# EAGLE design v2-quadcopter-control-board (EAGLE 5.12)
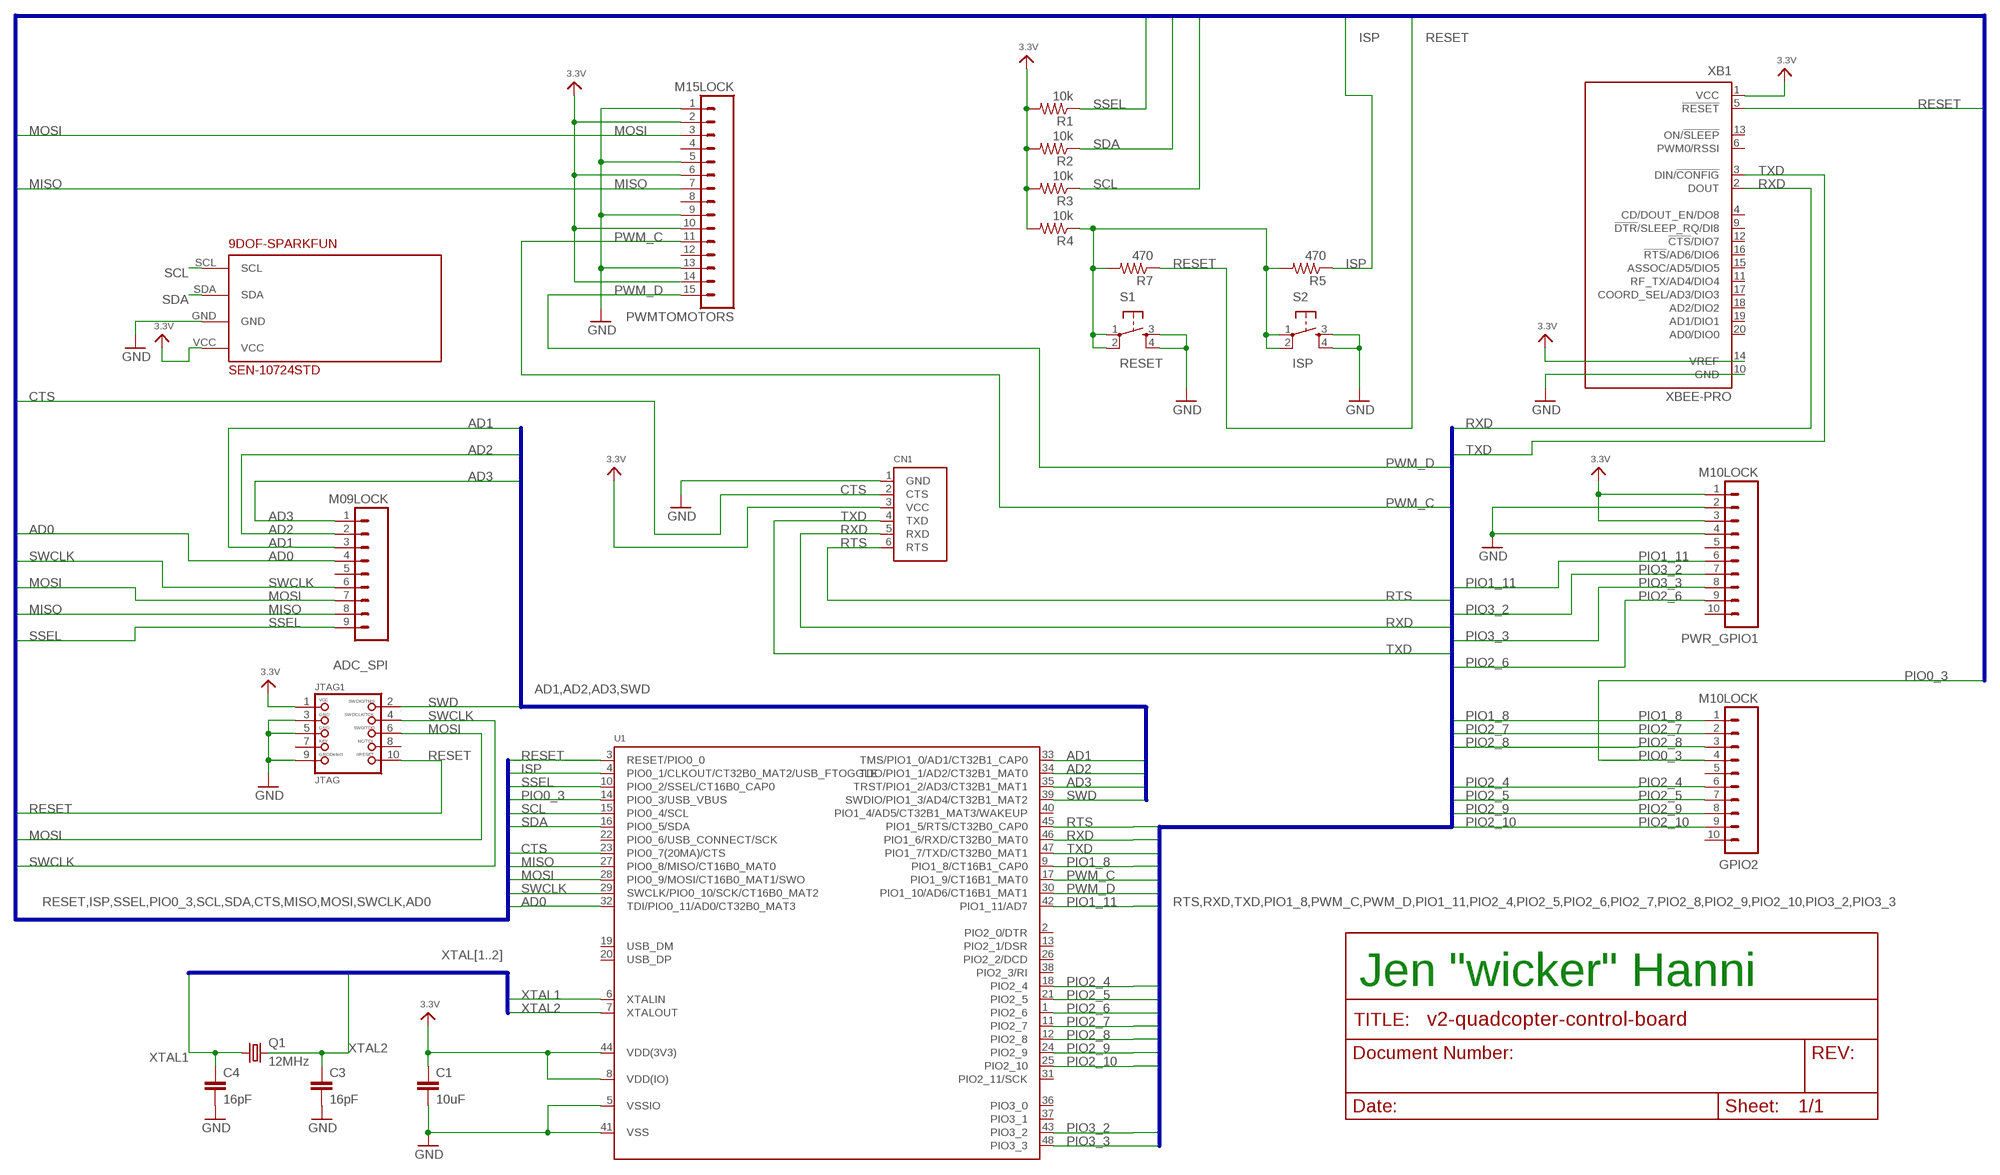
[diagram p0: schematic, sheet 1]

## Parts
9DOF-SPARKFUN  SEN-10724STD  [SPARKFUN-9DOF]
ADC_SPI  M09LOCK  [1X09_LOCK]
C1  10uF  CAP0603-CAP  [0603-CAP]
C3  16pF  CAP0603-CAP  [0603-CAP]
C4  16pF  CAP0603-CAP  [0603-CAP]
CN1  FTDIUSBCABLE  [1X06_ROUND]
GPIO2  M10LOCK  [1X10_LOCK]
JTAG1  JTAG  JTAG-CORTEXM3MOLEX  [CORTEXM3_SWD10_MOLEX]
PWMTOMOTORS  M15LOCK  [1X15_LOCK]
PWR_GPIO1  M10LOCK  [1X10_LOCK]
Q1  12MHz  CRYSTALCTS406  [CTS406]
R1  10k  RESISTOR0603-RES  [0603-RES]
R2  10k  RESISTOR0603-RES  [0603-RES]
R3  10k  RESISTOR0603-RES  [0603-RES]
R4  10k  RESISTOR0603-RES  [0603-RES]
R5  470  RESISTOR0603-RES  [0603-RES]
R7  470  RESISTOR0603-RES  [0603-RES]
S1  RESET  TAC_SWITCHSMD  [TACTILE_SWITCH_SMD]
S2  ISP  TAC_SWITCHSMD  [TACTILE_SWITCH_SMD]
U1  LPC1343_QFP  [LQFP48]
XB1  XBEE-PRO  [XBEE-PRO]

## Nets
3.3V: 9DOF-SPARKFUN.VCC C1.1 CN1.3(VCC) JTAG1.1 PWMTOMOTORS.2 PWMTOMOTORS.6 PWMTOMOTORS.10 PWMTOMOTORS.14 PWR_GPIO1.1 PWR_GPIO1.3 R1.2 R2.2 R3.2 R4.2 U1.8(VDD(IO)) U1.44(VDD(3V3)) XB1.1(VCC) XB1.14(VREF)
AD0: ADC_SPI.4 U1.32(TDI/PIO0_11/AD0/CT32B0_MAT3)
AD1: ADC_SPI.3 U1.33(TMS/PIO1_0/AD1/CT32B1_CAP0)
AD2: ADC_SPI.2 U1.34(TDO/PIO1_1/AD2/CT32B1_MAT0)
AD3: ADC_SPI.1 U1.35(TRST/PIO1_2/AD3/CT32B1_MAT1)
CTS: CN1.2(CTS) U1.23(PIO0_7(20MA)/CTS)
GND: 9DOF-SPARKFUN.GND C1.2 C3.2 C4.2 CN1.1(GND) JTAG1.3 JTAG1.5 JTAG1.9 PWMTOMOTORS.1 PWMTOMOTORS.5 PWMTOMOTORS.9 PWMTOMOTORS.13 PWR_GPIO1.2 PWR_GPIO1.4 S1.3 S1.4 S2.3 S2.4 U1.5(VSSIO) U1.41(VSS) XB1.10(GND)
ISP: R5.1 U1.4(PIO0_1/CLKOUT/CT32B0_MAT2/USB_FTOGGLE)
MISO: ADC_SPI.8 PWMTOMOTORS.7 U1.27(PIO0_8/MISO/CT16B0_MAT0)
MOSI: ADC_SPI.7 JTAG1.6 PWMTOMOTORS.3 U1.28(PIO0_9/MOSI/CT16B0_MAT1/SWO)
N$7: R4.1 R5.2 R7.2 S1.1 S1.2 S2.1 S2.2
PIO0_3: GPIO2.4 U1.14(PIO0_3/USB_VBUS)
PIO1_8: GPIO2.1 U1.9(PIO1_8/CT16B1_CAP0)
PIO1_11: PWR_GPIO1.6 U1.42(PIO1_11/AD7)
PIO2_4: GPIO2.6 U1.18(PIO2_4)
PIO2_5: GPIO2.7 U1.21(PIO2_5)
PIO2_6: PWR_GPIO1.9 U1.1(PIO2_6)
PIO2_7: GPIO2.2 U1.11(PIO2_7)
PIO2_8: GPIO2.3 U1.12(PIO2_8)
PIO2_9: GPIO2.8 U1.24(PIO2_9)
PIO2_10: GPIO2.9 U1.25(PIO2_10)
PIO3_2: PWR_GPIO1.7 U1.43(PIO3_2)
PIO3_3: PWR_GPIO1.8 U1.48(PIO3_3)
PWM_C: PWMTOMOTORS.11 U1.17(PIO1_9/CT16B1_MAT0)
PWM_D: PWMTOMOTORS.15 U1.30(PIO1_10/AD6/CT16B1_MAT1)
RESET: JTAG1.10 R7.1 U1.3(RESET/PIO0_0) XB1.5(!RESET)
RTS: CN1.6(RTS) U1.45(PIO1_5/RTS/CT32B0_CAP0)
RXD: CN1.5(RXD) U1.46(PIO1_6/RXD/CT32B0_MAT0) XB1.2(DOUT)
SCL: 9DOF-SPARKFUN.SCL R3.1 U1.15(PIO0_4/SCL)
SDA: 9DOF-SPARKFUN.SDA R2.1 U1.16(PIO0_5/SDA)
SSEL: ADC_SPI.9 R1.1 U1.10(PIO0_2/SSEL/CT16B0_CAP0)
SWCLK: ADC_SPI.6 JTAG1.4 U1.29(SWCLK/PIO0_10/SCK/CT16B0_MAT2)
SWD: JTAG1.2 U1.39(SWDIO/PIO1_3/AD4/CT32B1_MAT2)
TXD: CN1.4(TXD) U1.47(PIO1_7/TXD/CT32B0_MAT1) XB1.3(DIN/!CONFIG)
XTAL1: C4.1 Q1.1 U1.6(XTALIN)
XTAL2: C3.1 Q1.3 U1.7(XTALOUT)
Unconnected: ADC_SPI.5 GPIO2.5 GPIO2.10 JTAG1.7 JTAG1.8 PWMTOMOTORS.4 PWMTOMOTORS.8 PWMTOMOTORS.12 PWR_GPIO1.5 PWR_GPIO1.10 U1.2(PIO2_0/DTR) U1.13(PIO2_1/DSR) U1.19(USB_DM) U1.20(USB_DP) U1.22(PIO0_6/USB_CONNECT/SCK) U1.26(PIO2_2/DCD) U1.31(PIO2_11/SCK) U1.36(PIO3_0) U1.37(PIO3_1) U1.38(PIO2_3/RI) U1.40(PIO1_4/AD5/CT32B1_MAT3/WAKEUP) XB1.4(CD/DOUT_EN/DO8) XB1.6(PWM0/RSSI) XB1.9(!DTR!/SLEEP_RQ/DI8) XB1.11(RF_TX/AD4/DIO4) XB1.12(!CTS!/DIO7) XB1.13(ON/!SLEEP) XB1.15(ASSOC/AD5/DIO5) XB1.16(!RTS!/AD6/DIO6) XB1.17(COORD_SEL/AD3/DIO3) XB1.18(AD2/DIO2) XB1.19(AD1/DIO1) XB1.20(AD0/DIO0)

## Buses
XTAL[1..2]
RESET,ISP,SSEL,PIO0_3,SCL,SDA,CTS,MISO,MOSI,SWCLK,AD0
AD1,AD2,AD3,SWD
RTS,RXD,TXD,PIO1_8,PWM_C,PWM_D,PIO1_11,PIO2_4,PIO2_5,PIO2_6,PIO2_7,PIO2_8,PIO2_9,PIO2_10,PIO3_2,PIO3_3

## Notes on the sheet
- Jen "wicker" Hanni

## Library data of the parts
9DOF-SPARKFUN = wicker:SEN-10724
ADC_SPI = sparkfun:M09: Header 9 Standard 9-pin 0.1" header. Use with straight break away headers (SKU : PRT-00116), right angle break away headers (PRT-00553), swiss pins (PRT-00743), machine pins (PRT-00117), and female headers (PRT-00115).
C1 C3 C4 = sparkfun:CAP: Capacitor Standard 0603 ceramic capacitor, and 0.1" leaded capacitor.
CN1 = microbuilder:FTDIUSBCABLE: FTDI TTL-232R USB Cable Connector for FTDI's USB->RS232 Cable
GPIO2 PWR_GPIO1 = sparkfun:M10: Header 10 Standard 10-pin 0.1" header. Use with straight break away headers (SKU : PRT-00116), right angle break away headers (PRT-00553), swiss pins (PRT-00743), machine pins (PRT-00117), and female headers (PRT-00115).
JTAG1 = microbuilder:JTAG-CORTEXM3: Serial Wire (SW-DP) Connector This standard 0.05" 10-pin connector is for use with the Cortex M0/M3's native SWD (serial wire debugger) interface (SW-DP). Some boards support a 20-pin combined JTAG+SWD connector (SWJ-DP), such as the LPC1700 family, but many smaller devices only work with SWD which typically use the smaller 10-pin SW-DP connecter (the LPC1300 family, for example, only supports SWD). 2x05 1.27mm/0.05" Connector: This is the standard SMT connector defined by ARM for all Cortex devices, and should be used in most situations and for forward-compatibility since any new devices coming to market will likely use this connector. MOLEX 10 Pin 0.1" Connector: This 0.1" 10 pin connector has the same pin layout as the standard 0.05" connector, but is easier to work with if you are using standard jumper wires or custom cables to connect your SWD hardware. MOLEX 20 Pin 0.1" Connector: This 0.1" 20 pin connector is the same model used for ARM7/ARM9 JTAG debuggers, but is connected to match the pins on the Segger J-Link for ARM (which supports both JTAG and SWD debugging). See the following document from ARM for more information on Cortex M3 Debug Connectors: http://infocenter.arm.com/help/topic/com.arm.doc.faqs/attached/13634/cortex_debug_connectors.pdf And the following page for an overview with images of the different connector types: http://www.keil.com/peripherals/coresight/connectors.asp
PWMTOMOTORS = sparkfun:M15: Header 15 Standard 15-pin 0.1" header. Use with straight break away headers (SKU : PRT-00116), right angle break away headers (PRT-00553), swiss pins (PRT-00743), machine pins (PRT-00117), and female headers (PRT-00115).
Q1 = crystal:CRYSTAL: CRYSTAL
R1-R5 R7 = sparkfun:RESISTOR: Resistor Basic schematic elements and footprints for 0603, 1206, and PTH resistors.
S1 S2 = sparkfun:TAC_SWITCH: Momentary Switch Button commonly used for reset or general input. Spark Fun Electronics SKU : COM-00097
U1 = microbuilder:LPC1343_QFP: LPC1343 72 MHz 32-bit ARM Cortex-M3 microcontroller. 32 kB Flash, 8 kB SRAM, USB Device Mouser: 771-LPC1343FBD48151 Digikey: 568-4945-ND; DIGIKEY#: 568-4945-ND; MANF: NXP; MANF#: LPC1343FBD48,151
XB1 = microbuilder:XBEE: XBee (TM) /XBee-PRO(TM) OEM RF Modules Source: MaxStream, Inc. xbee_productmanual.pdf

## Board
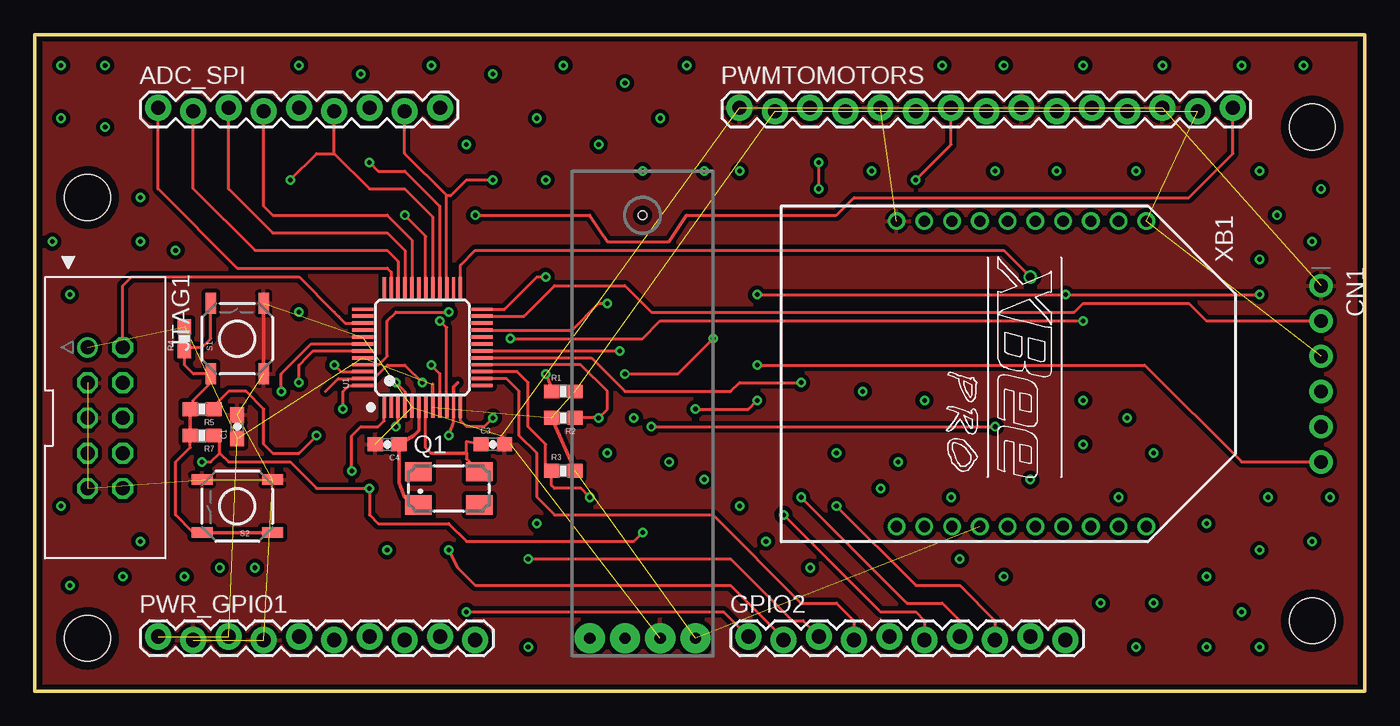
[diagram p1: board, top side]
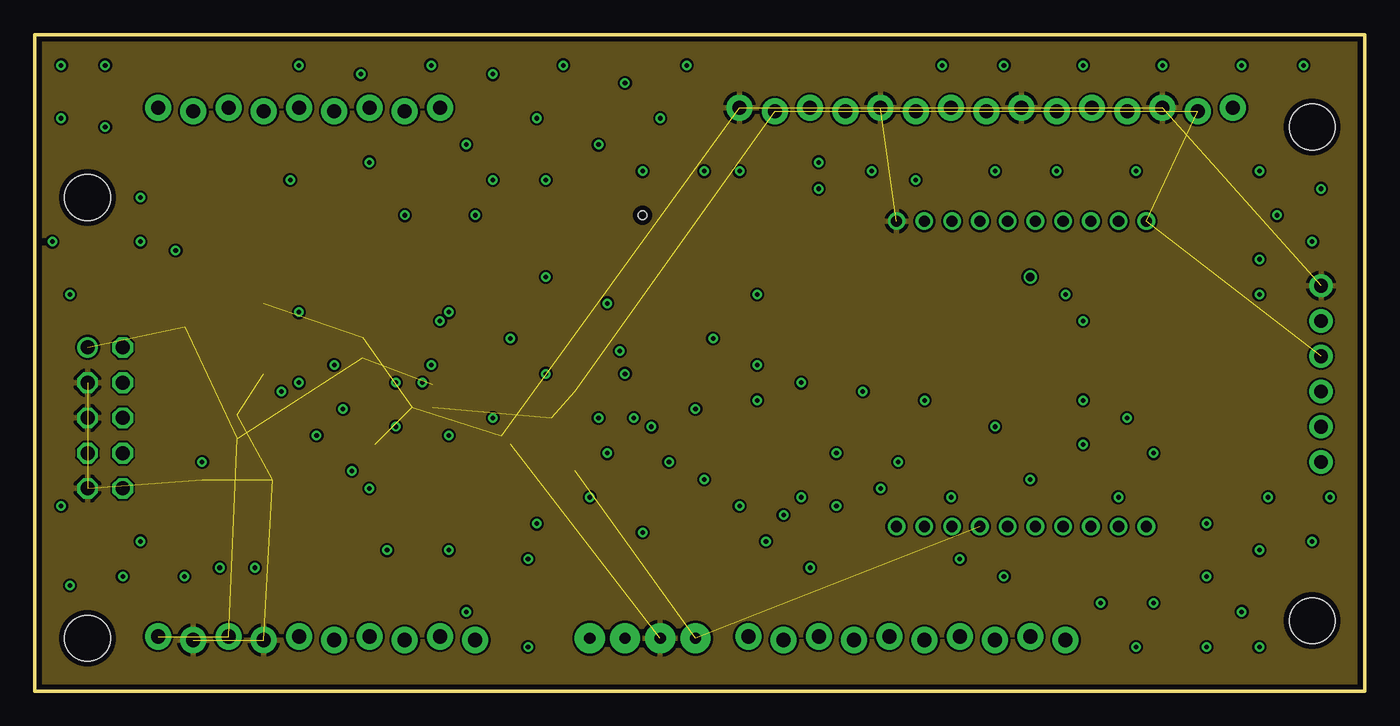
[diagram p2: board, inner layer $GND-PLANE]
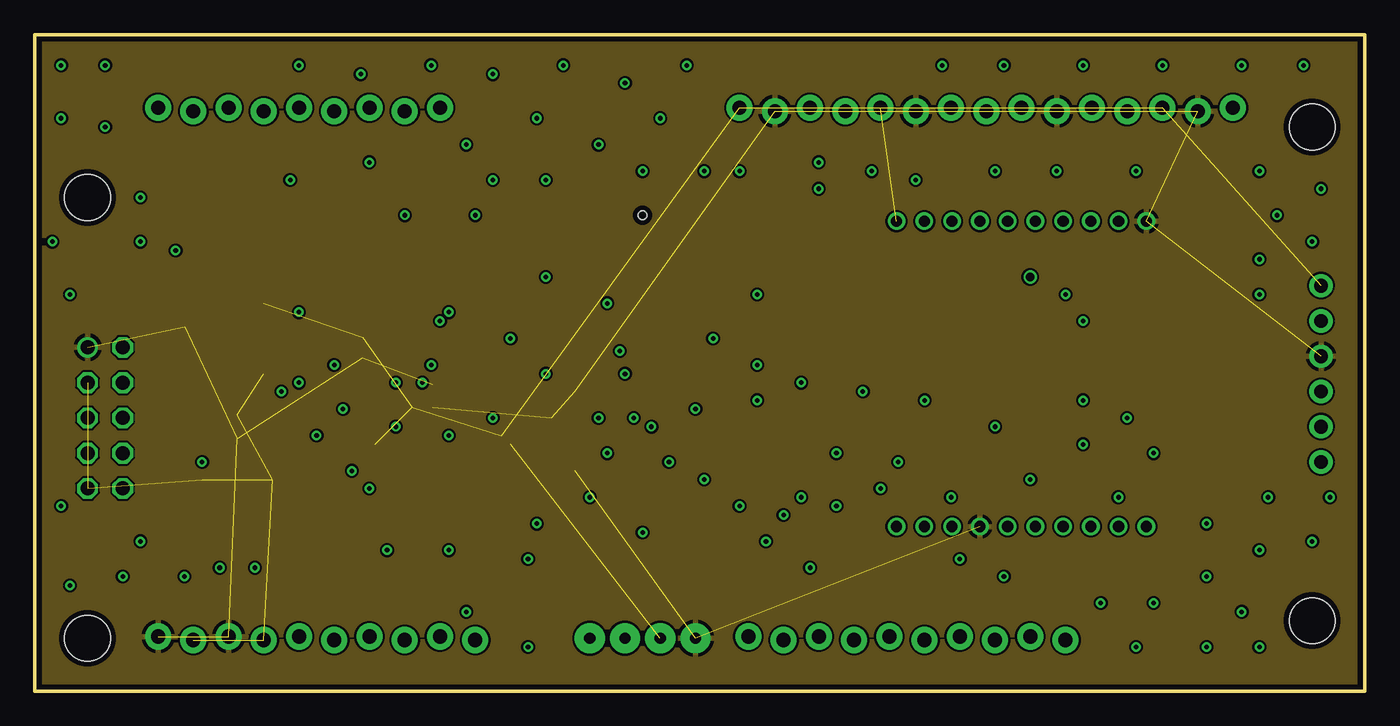
[diagram p3: board, inner layer $POWER-PLANE]
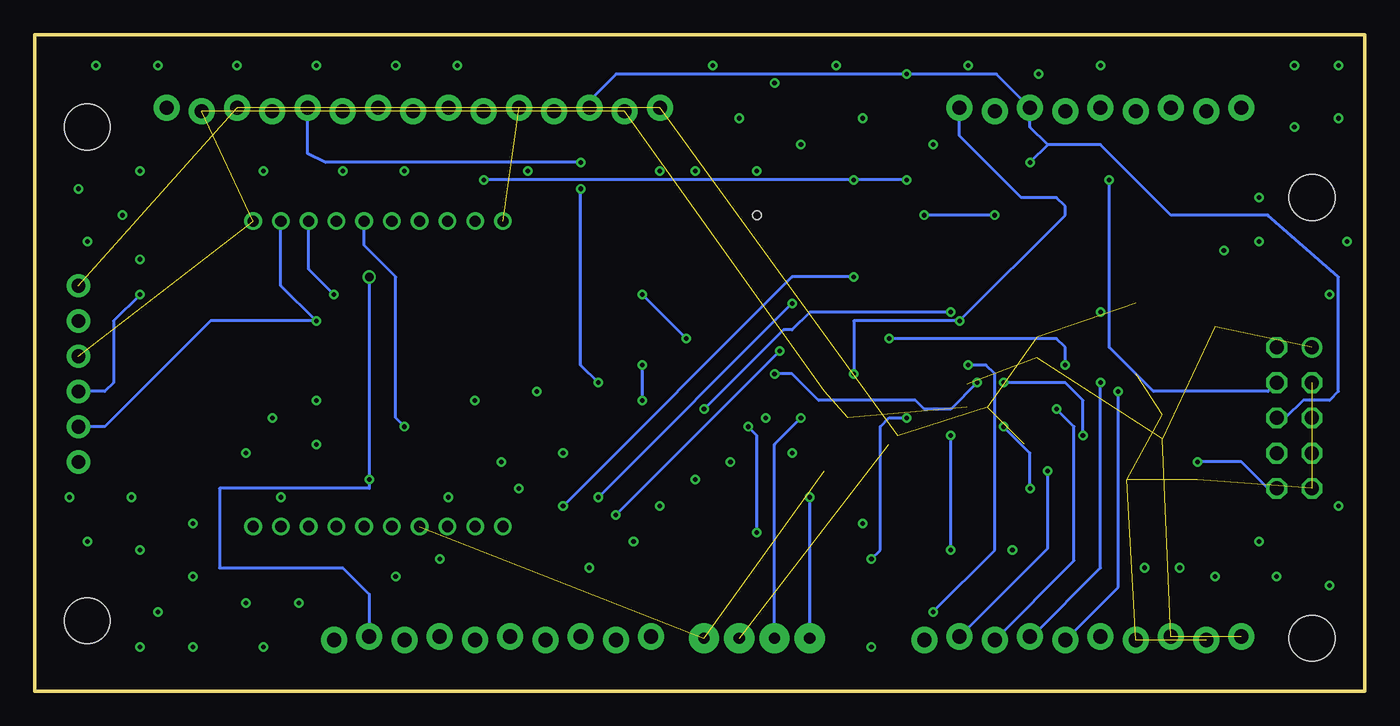
[diagram p4: board, bottom side, seen from below]

Size 95.86 x 47.3 mm. Coordinates in mm from the lower left corner, seen from the top.
Outline: 0,0 95.86,0 95.86,47.3 0,47.3 0,0
Copper layers (1*2+15*16): Top 0.0356mm / dielectric 1.5011mm / $GND-PLANE 0.0356mm / dielectric 0.1499mm / $POWER-PLANE 0.0356mm / dielectric 0.2007mm / Bottom 0.0356mm
Design rules "LaenPCBOrder *": minimum track width 6mil, minimum drill 13mil, track to track 6mil, track to pad 6mil, pad to pad 6mil, via to via 6mil, smd to smd 6mil, copper to edge 15mil, drill to drill 6mil, minimum pad ring 7mil, minimum via ring 7mil, stop-mask expansion 4mil, vias tented up to drill 0mil, thermal gap 10mil

### Footprints (pad centres in the part's own frame; a part is rotated, then mirrored left to right if it is on the bottom)
SPARKFUN-9DOF = drill 0.8 pad 2.184 round: GND 1.27,3.81; SCL 1.27,8.89; SDA 1.27,6.35; VCC 1.27,1.27 | hole 0.6: 31.75,5.08
1X09_LOCK = drill 1.016 pad 1.88 round: 1 0,0.127; 2 2.54,-0.127; 3 5.08,0.127; 4 7.62,-0.127; 5 10.16,0.127; 6 12.7,-0.127; 7 15.24,0.127; 8 17.78,-0.127; 9 20.32,0.127
0603-CAP = smd 1.1 x 1: 1 -0.85,0; 2 0.85,0
1X06_ROUND = drill 1 pad 1.676 round: 1 -6.35,0; 2 -3.81,0; 3 -1.27,0; 4 1.27,0; 5 3.81,0; 6 6.35,0
1X10_LOCK = drill 1.016 pad 1.88 round: 1 0,0.127; 2 2.54,-0.127; 3 5.08,0.127; 4 7.62,-0.127; 5 10.16,0.127; 6 12.7,-0.127; 7 15.24,0.127; 8 17.78,-0.127; 9 20.32,0.127; 10 22.86,-0.127
CORTEXM3_SWD10_MOLEX = drill 1 round: 1 -5.08,-1.27 | drill 1 octagon: 2 -5.08,1.27; 3 -2.54,-1.27; 4 -2.54,1.27; 5 0,-1.27; 6 0,1.27; 7 2.54,-1.27; 8 2.54,1.27; 9 5.08,-1.27; 10 5.08,1.27
1X15_LOCK = drill 1.016 pad 1.88 round: 1 0,0.127; 2 2.54,-0.127; 3 5.08,0.127; 4 7.62,-0.127; 5 10.16,0.127; 6 12.7,-0.127; 7 15.24,0.127; 8 17.78,-0.127; 9 20.32,0.127; 10 22.86,-0.127; 11 25.4,0.127; 12 27.94,-0.127; 13 30.48,0.127; 14 33.02,-0.127; 15 35.56,0.127
CTS406 = smd 1.9 x 1.4: 1 -2.2,-1.2; 2 2.2,-1.2; 3 2.2,1.2; 4 -2.2,1.2
0603-RES = smd 1.1 x 1: 1 -0.85,0; 2 0.85,0
TACTILE_SWITCH_SMD = smd 1.524 x 0.762: 1 -2.54,1.905; 2 2.54,1.905; 3 -2.54,-1.905; 4 2.54,-1.905
LQFP48 = smd 1.5 x 0.25: 1 -4.3,2.75; 2 -4.3,2.25; 3 -4.3,1.75; 4 -4.3,1.25; 5 -4.3,0.75; 6 -4.3,0.25; 7 -4.3,-0.25; 8 -4.3,-0.75; 9 -4.3,-1.25; 10 -4.3,-1.75; 11 -4.3,-2.25; 12 -4.3,-2.75; 25 4.3,-2.75; 26 4.3,-2.25; 27 4.3,-1.75; 28 4.3,-1.25; 29 4.3,-0.75; 30 4.3,-0.25; 31 4.3,0.25; 32 4.3,0.75; 33 4.3,1.25; 34 4.3,1.75; 35 4.3,2.25; 36 4.3,2.75 | smd 0.25 x 1.5: 13 -2.75,-4.3; 14 -2.25,-4.3; 15 -1.75,-4.3; 16 -1.25,-4.3; 17 -0.75,-4.3; 18 -0.25,-4.3; 19 0.25,-4.3; 20 0.75,-4.3; 21 1.25,-4.3; 22 1.75,-4.3; 23 2.25,-4.3; 24 2.75,-4.3; 37 2.75,4.3; 38 2.25,4.3; 39 1.75,4.3; 40 1.25,4.3; 41 0.75,4.3; 42 0.25,4.3; 43 -0.25,4.3; 44 -0.75,4.3; 45 -1.25,4.3; 46 -1.75,4.3; 47 -2.25,4.3; 48 -2.75,4.3
STAND-OFF = hole 3.302: 0,0
XBEE-PRO = drill 0.8 pad 1.27 round: 1 -11,9; 2 -11,7; 3 -11,5; 4 -11,3; 5 -11,1; 6 -11,-1; 7 -11,-3; 8 -11,-5; 9 -11,-7; 10 -11,-9; 11 11,-9; 12 11,-7; 13 11,-5; 14 11,-3; 15 11,-1; 16 11,1; 17 11,3; 18 11,5; 19 11,7; 20 11,9

### Placement (x,y rotation side)
9DOF-SPARKFUN  48.9,2.54 90 top
ADC_SPI  8.89,41.91 0 top
C1  14.61,19.05 90 top
C3  33.02,17.78 0 top
C4  25.4,17.78 180 top
CN1  92.71,22.86 270 top
GPIO2  51.44,3.81 0 top
JTAG1  5.08,19.68 270 top
PWMTOMOTORS  50.8,41.91 0 top
PWR_GPIO1  8.89,3.81 0 top
Q1  29.84,14.61 0 top
R1  38.1,21.59 0 top
R2  38.1,19.68 180 top
R3  38.1,15.88 0 top
R4  10.79,25.4 90 top
R5  12.06,20.32 180 top
R7  12.06,18.41 180 top
S1  14.61,25.4 90 top
S2  14.61,13.34 180 top
U1  27.94,24.77 90 top
U$4  [STAND-OFF]  3.81,35.56 0 top
U$5  [STAND-OFF]  3.81,3.81 0 top
U$6  [STAND-OFF]  92.08,40.64 0 top
U$7  [STAND-OFF]  92.08,5.08 0 top
XB1  71.12,22.86 270 top

### Tracks (layer width: path | path; a pad name or v marks a point on that pad's centre or on a via)
3.3V  (16 unrouted)
  Top 0.254: R3.2 R2.2 | U1.8 28.69,22.11
  pour $POWER-PLANE: 95.89,46.99 95.89,0 0,0 0,46.99
AD0
  Top 0.203: U1.32 27.19,32.5 25.4,34.29 17.14,34.29 16.51,34.92 ADC_SPI.4
AD1
  Top 0.203: U1.33 26.69,31.73 25.4,33.02 17.14,33.02 13.97,36.2 ADC_SPI.3
AD2
  Top 0.203: U1.34 26.19,30.96 25.4,31.75 15.88,31.75 11.43,36.2 ADC_SPI.2
AD3
  Top 0.203: U1.35 25.69,30.19 25.4,30.48 14.61,30.48 8.89,36.2 ADC_SPI.1
CTS
  Top 0.203: U1.23 35.27,27.02 37.47,29.21 42.55,29.21 44.45,27.3 74.93,27.3 75.56,27.94 83.19,27.94 84.45,26.67 CN1.2
GND  (19 unrouted)
  Top 0.254: S1.3 S1.4 | C3.2 33.66,18.41 34.29,17.78
  pour $GND-PLANE: 0,0 95.89,0 95.89,47.62 0,47.62
  pour Top (isolate 0.305): 0.64,46.99 0.64,0 95.25,0 95.25,46.99
ISP  (via drill 0.33)
  Top 0.203: U1.4 26.69,21.57 v26.04,22.23 | R5.1 12.91,20.54 13.97,21.59 15.24,21.59 16.51,20.32 16.51,17.78 17.14,17.14 19.05,17.14 v20.32,18.41
  Bottom 0.203: v26.04,22.23 21.59,22.23 20.32,20.95 v20.32,18.41
MISO  (via drill 0.33)
  Top 0.203: U1.27 29.69,35.72 | 29.69,35.72 26.67,38.73 ADC_SPI.8 | 29.69,35.72 30,35.72 31.11,36.83 v33.02,36.83 | PWMTOMOTORS.7 66.04,39.37 v63.5,36.83
  Bottom 0.203: v33.02,36.83 v36.83,36.83 v63.5,36.83
MOSI  (via drill 0.33)
  Top 0.203: U1.28 29.19,34.95 26.67,37.47 24.77,37.47 v24.13,38.1
  Bottom 0.203: JTAG1.6 5.71,19.68 4.45,20.95 2.54,20.95 1.91,21.59 1.91,29.84 6.99,34.29 13.97,34.29 19.05,39.37 22.86,39.37 | 22.86,39.37 24.13,40.64 ADC_SPI.7 26.54,44.45 v33.02,44.45 53.98,44.45 55.88,42.55 PWMTOMOTORS.3 | 22.86,39.37 v24.13,38.1
N$1  (via drill 0.33)
  other vias: 1.91,45.09
N$2  (via drill 0.33)
  other vias: 1.91,41.27
N$3  (via drill 0.33)
  other vias: 5.08,45.09
N$4  (via drill 0.33)
  other vias: 5.08,40.64
N$5  (via drill 0.33)
  other vias: 19.05,45.09
N$6  (via drill 0.33)
  other vias: 23.5,44.45
N$7
  Top 0.203: S1.2 12.7,25.4 12.06,24.77 11.01,24.77 R4.1 10.79,23.5 11.43,22.86 S1.1 12.7,22.23 11.43,20.95 11.43,20.54 R5.2 | R7.2 11.21,17.57 10.16,16.51 10.16,12.7 11.43,11.43 S2.2
  Top 0.254: R7.2 R5.2 | S2.2 S2.1
N$8  (via drill 0.33)
  other vias: 28.57,45.09
N$9  (via drill 0.33)
  other vias: 38.1,45.09
N$10  (via drill 0.33)
  other vias: 42.55,43.81
N$11  (via drill 0.33)
  other vias: 46.99,45.09
N$12  (via drill 0.33)
  other vias: 36.2,41.27
N$13  (via drill 0.33)
  other vias: 45.09,41.27
N$14  (via drill 0.33)
  other vias: 40.64,39.37
N$15  (via drill 0.33)
  other vias: 31.11,39.37
N$16  (via drill 0.33)
  other vias: 43.81,37.47
N$17  (via drill 0.33)
  other vias: 50.8,37.47
N$18  (via drill 0.33)
  other vias: 48.26,37.47
N$19  (via drill 0.33)
  other vias: 60.33,37.47
N$20  (via drill 0.33)
  other vias: 69.22,37.47
N$21  (via drill 0.33)
  other vias: 73.66,37.47
N$22  (via drill 0.33)
  other vias: 79.38,37.47
N$23  (via drill 0.33)
  other vias: 65.41,45.09
N$24  (via drill 0.33)
  other vias: 69.85,45.09
N$25  (via drill 0.33)
  other vias: 75.56,45.09
N$26  (via drill 0.33)
  other vias: 81.28,45.09
N$27  (via drill 0.33)
  other vias: 87,45.09
N$28  (via drill 0.33)
  other vias: 91.44,45.09
N$29  (via drill 0.33)
  other vias: 88.27,37.47
N$30  (via drill 0.33)
  other vias: 92.71,36.2
N$31  (via drill 0.33)
  other vias: 89.53,34.29
N$32  (via drill 0.33)
  other vias: 92.08,32.38
N$33  (via drill 0.33)
  other vias: 88.27,31.11
N$34  (via drill 0.33)
  other vias: 93.34,13.97
N$35  (via drill 0.33)
  other vias: 88.9,13.97
N$36  (via drill 0.33)
  other vias: 84.45,12.06
N$37  (via drill 0.33)
  other vias: 88.27,10.16
N$38  (via drill 0.33)
  other vias: 92.08,10.79
N$39  (via drill 0.33)
  other vias: 84.45,8.26
N$40  (via drill 0.33)
  other vias: 80.64,6.35
N$41  (via drill 0.33)
  other vias: 76.83,6.35
N$42  (via drill 0.33)
  other vias: 79.38,3.17
N$43  (via drill 0.33)
  other vias: 84.45,3.17
N$44  (via drill 0.33)
  other vias: 87,5.71
N$45  (via drill 0.33)
  other vias: 88.27,3.17
N$46  (via drill 0.33)
  other vias: 69.85,8.26
N$47  (via drill 0.33)
  other vias: 66.67,9.53
N$48  (via drill 0.33)
  other vias: 55.88,8.89
N$49  (via drill 0.33)
  other vias: 52.7,10.79
N$50  (via drill 0.33)
  other vias: 50.8,13.34
N$51  (via drill 0.33)
  other vias: 48.26,15.24
N$52  (via drill 0.33)
  other vias: 45.72,16.51
N$53  (via drill 0.33)
  other vias: 57.78,17.14
N$54  (via drill 0.33)
  other vias: 60.96,14.61
N$55  (via drill 0.33)
  other vias: 62.23,16.51
N$56  (via drill 0.33)
  other vias: 66.04,13.97
N$57  (via drill 0.33)
  other vias: 78.11,13.97
N$58  (via drill 0.33)
  other vias: 80.64,17.14
N$59  (via drill 0.33)
  other vias: 78.74,19.68
N$60  (via drill 0.33)
  other vias: 75.56,20.95
N$61  (via drill 0.33)
  other vias: 75.56,17.78
N$62  (via drill 0.33)
  other vias: 64.14,20.95
N$63  (via drill 0.33)
  other vias: 59.69,21.59
N$64  (via drill 0.33)
  other vias: 43.18,19.68
N$65  (via drill 0.33)
  other vias: 41.27,17.14
N$66  (via drill 0.33)
  other vias: 36.2,12.06
N$67  (via drill 0.33)
  other vias: 25.4,10.16
N$68  (via drill 0.33)
  other vias: 15.88,8.89
N$69  (via drill 0.33)
  other vias: 13.34,8.89
N$70  (via drill 0.33)
  other vias: 10.79,8.26
N$71  (via drill 0.33)
  other vias: 6.35,8.26
N$72  (via drill 0.33)
  other vias: 2.54,7.62
N$73  (via drill 0.33)
  other vias: 7.62,32.38
N$74  (via drill 0.33)
  other vias: 10.16,31.75
N$75  (via drill 0.33)
  other vias: 7.62,35.56
N$76  (via drill 0.33)
  other vias: 1.27,32.38
N$77  (via drill 0.33)
  other vias: 2.54,28.57
N$78  (via drill 0.33)
  other vias: 1.91,13.34
N$79  (via drill 0.33)
  other vias: 7.62,10.79
N$80  (via drill 0.33)
  other vias: 19.05,27.3
N$81  (via drill 0.33)
  other vias: 35.56,3.17
PIO0_3
  Top 0.203: U1.14 34,22.52 34.92,21.59 34.92,18.41 36.2,17.14 36.2,13.97 37.47,12.7 48.9,12.7 55.24,6.35 57.78,6.35 59.05,5.08 GPIO2.4
PIO1_8  (via drill 0.33)
  Top 0.203: U1.9 29.19,22.88 v28.57,23.5 | v31.11,5.71 49.66,5.71 GPIO2.1
  Bottom 0.203: v31.11,5.71 26.67,10.16 26.67,22.86 27.3,23.5 v28.57,23.5
PIO1_11  (via drill 0.33)
  Top 0.203: U1.42 19.93,25.02 17.78,22.86 v17.78,21.59
  Bottom 0.203: v17.78,21.59 17.78,7.49 PWR_GPIO1.6
PIO2_4  (via drill 0.33)
  Top 0.203: U1.18 v42.16,24.52 | GPIO2.6 64.14,5.08 63.5,5.71 60.96,5.71 v53.98,12.7
  Bottom 0.203: v53.98,12.7 43.81,22.86 43.18,23.5 v42.16,24.52
PIO2_5  (via drill 0.33)
  Top 0.203: U1.21 38.72,26.02 40.64,27.94 v41.27,27.94 | GPIO2.7 66.67,5.08 65.41,6.35 62.87,6.35 v55.24,13.97
  Bottom 0.203: v41.27,27.94 v55.24,13.97
PIO2_6  (via drill 0.33)
  Top 0.203: U1.1 25.19,19.48 24.77,19.05 23.5,19.05 22.86,18.41 v22.86,15.88
  Bottom 0.203: v22.86,15.88 22.86,10.29 PWR_GPIO1.9
PIO2_7  (via drill 0.33)
  Top 0.203: GPIO2.2 53.98,3.81 50.16,7.62 31.75,7.62 30.48,8.89 v29.84,10.16 | U1.11 30.19,19.34 v29.84,18.41
  Top 0.254: U1.11 30.19,21.93 30.48,22.23
  Bottom 0.203: v29.84,10.16 v29.84,18.41
PIO2_8  (via drill 0.33)
  Top 0.203: U1.12 30.69,19.48 31.11,19.05 32.38,19.05 v33.02,19.68 | v35.56,9.53 50.16,9.53 54.61,5.08 55.37,5.08 GPIO2.3
  Bottom 0.203: v33.02,19.68 34.29,19.68 34.92,19.05 34.92,10.16 v35.56,9.53
PIO2_9  (via drill 0.33)
  Top 0.203: U1.24 33.87,27.52 36.2,29.84 v36.83,29.84 | GPIO2.8 69.22,5.08 66.67,7.62 63.5,7.62 v57.78,13.34
  Bottom 0.203: v36.83,29.84 41.27,29.84 v57.78,13.34
PIO2_10  (via drill 0.33, 0.6)
  Top 0.203: U1.25 30.69,30.69 31.75,31.75 69.85,31.75 v71.75,29.84
  Bottom 0.203: v71.75,29.84 v71.75,15.24 71.75,14.61 82.55,14.61 82.55,8.89 73.66,8.89 71.75,6.99 GPIO2.9
PIO3_2  (via drill 0.33)
  Top 0.203: U1.43 20.07,24.52 19.68,24.13 19.05,23.5 v19.05,22.23
  Bottom 0.203: PWR_GPIO1.7 24,3.94 19.05,8.89 v19.05,22.23
PIO3_3  (via drill 0.33)
  Top 0.203: U1.48 22.65,22.02 22.23,21.59 v22.23,20.32
  Bottom 0.203: v22.23,20.32 20.95,19.05 20.95,9.4 PWR_GPIO1.8
PWM_C  (via drill 0.33)
  Top 0.203: U1.17 40.12,24.02 42.55,21.59 50.16,21.59 50.8,22.23 v55.24,22.23 | v56.52,36.2 v56.52,38.1
  Bottom 0.203: PWMTOMOTORS.11 76.2,38.73 74.93,38.1 v56.52,38.1 | v55.24,22.23 56.52,23.5 v56.52,36.2
PWM_D  (via drill 0.33)
  Top 0.203: U1.30 28.19,32.77 v26.67,34.29 | v31.75,34.29 40.01,34.29 41.27,32.38 45.72,32.38 46.99,34.29 57.78,34.29 59.05,35.56 83.19,35.56 86.36,38.73 PWMTOMOTORS.15
  Bottom 0.203: v26.67,34.29 v31.75,34.29
RESET  (via drill 0.33)
  Top 0.203: U1.3 26.19,19.2 v26.04,19.05 | 13.34,17.14 13.97,16.51 18.41,16.51 20.32,14.61 v24.13,14.61 24.13,12.7 24.77,12.06 29.84,12.06 31.11,10.79 43.18,10.79 v43.81,11.43 | 13.34,17.14 13.34,18 R7.1 | v12.06,16.51 12.7,16.51 13.34,17.14 | v44.45,19.05 v69.22,19.05
  Bottom 0.203: v26.04,19.05 24.13,17.14 v24.13,14.61 | JTAG1.10 6.99,14.61 8.89,16.51 v12.06,16.51 | XB1.5 72.12,32.12 69.85,29.84 69.85,19.68 v69.22,19.05 | v44.45,19.05 43.81,18.41 v43.81,11.43
RTS  (via drill 0.33)
  Top 0.203: CN1.6 87,16.51 80.01,23.5 v52.07,23.5 | U1.45 24.79,23.52 25.4,24.13 25.4,26.67 26.04,27.3 v29.84,27.3 | v47.62,20.32 51.44,20.32 v52.07,20.95
  Bottom 0.203: v29.84,27.3 40.01,27.3 41.27,26.04 41.91,26.04 v47.62,20.32 | v52.07,20.95 v52.07,23.5
RXD  (via drill 0.33)
  Top 0.203: v75.56,26.67 45.09,26.67 43.81,25.4 v34.29,25.4 | U1.46 22.07,23.02 v21.59,23.5
  Bottom 0.203: XB1.2 78.12,29.23 v75.56,26.67 83.19,26.67 90.81,19.05 CN1.5 | v21.59,23.5 21.59,24.77 22.23,25.4 v34.29,25.4
SCL  (via drill 0.33)
  Top 0.203: U1.15 34.77,23.02 35.56,22.23 35.56,19.05 36.83,17.78 36.83,16.3 R3.1 37.25,14.82 37.47,14.61 39.37,14.61 v40.01,13.97
  Bottom 0.203: 9DOF-SPARKFUN.SCL v40.01,13.97
SDA  (via drill 0.33)
  Top 0.203: U1.16 39.35,23.52 41.27,21.59 41.27,20.32 v40.64,19.68 R2.1
  Bottom 0.203: 9DOF-SPARKFUN.SDA 42.55,17.78 v40.64,19.68
SSEL  (via drill 0.33)
  Top 0.203: U1.10 29.69,26.19 v29.21,26.67 | R1.1 37.25,21.8 v36.83,22.86
  Bottom 0.203: ADC_SPI.9 29.21,40.01 24.77,35.56 22.23,35.56 21.59,34.92 21.59,34.29 v29.21,26.67 36.83,26.67 v36.83,22.86
SWCLK  (via drill 0.33)
  Top 0.203: U1.29 28.69,34.17 26.67,36.2 24.13,36.2 21.59,38.73 | 21.59,38.73 ADC_SPI.6 | 21.59,38.73 20.32,38.73 v18.41,36.83
  Bottom 0.203: v18.41,36.83 18.41,24.77 15.24,21.59 6.99,21.59 JTAG1.4
SWD
  Top 0.203: U1.39 22.38,26.52 21.91,26.99 21.59,27.3 19.05,29.84 6.99,29.84 6.35,29.21 JTAG1.2
TXD  (via drill 0.33)
  Top 0.203: 20.95,21.59 21.88,22.52 U1.47 24.42,22.52 25.4,23.5 26.67,23.5 v27.94,22.23 | v52.07,28.57 v74.3,28.57 v88.27,28.57 | v48.9,25.4 46.35,22.86 v42.55,22.86
  Bottom 0.203: XB1.3 76.12,30.4 v74.3,28.57 | CN1.4 90.81,21.59 90.17,22.23 90.17,26.67 v88.27,28.57 | v48.9,25.4 v52.07,28.57 | v42.55,22.86 41.27,22.86 39.37,20.95 32.38,20.95 31.75,20.32 29.84,20.32 v27.94,22.23
XTAL1
  Top 0.254: Q1.1 27.57,13.97 26.67,13.97 26.25,15.03 C4.1 27.3,18.41 27.69,18.8 U1.6
XTAL2
  Top 0.203: Q1.3 31.11,16.73 31.11,17.14 31.11,18 C3.1 | U1.7 28.19,17.53 28.57,17.14
  Top 0.254: 28.57,17.14 31.11,17.14